# EAGLE schematic drivercontrols_adafruit_M0 (EAGLE 9.5.2)
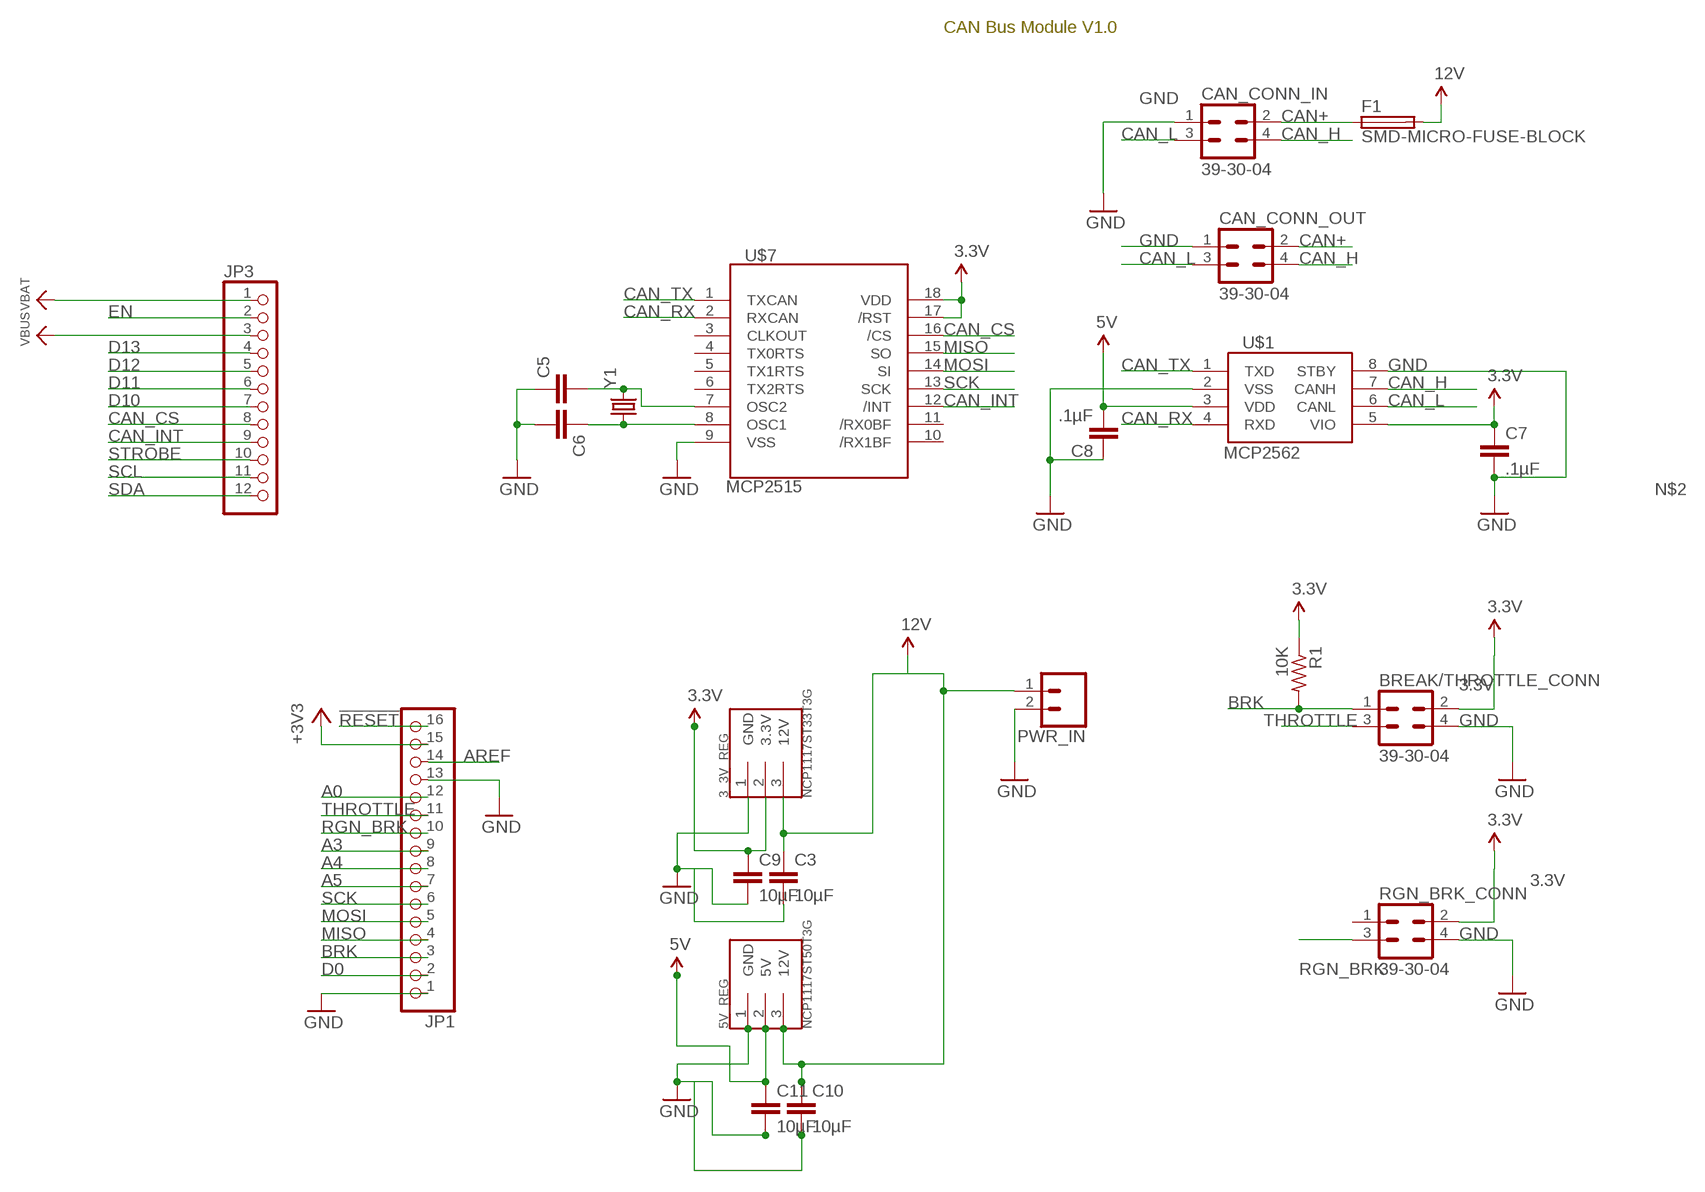
[diagram p0: schematic, sheet 1]

## Parts
3_3V_REG  NCP1117ST33T3G  [SOT223]
5V_REG  NCP1117ST50T3G  [SOT223]
BREAK/THROTTLE_CONN  39-30-04  [39-30-?04?]
C3  10µF  CAP0805  [0805]
C5  CAP0805  [0805]
C6  CAP0805  [0805]
C7  .1µF  CAP0805  [0805]
C8  .1µF  CAP0805  [0805]
C9  10µF  CAP0805  [0805]
C10  10µF  CAP0805  [0805]
C11  10µF  CAP0805  [0805]
CAN_CONN_IN  39-30-04  [39-30-?04?]
CAN_CONN_OUT  39-30-04  [39-30-?04?]
F1  SMD-MICRO-FUSE-BLOCK  [OMNIBLOK]
JP1  HEADER-1X16ROUND  [1X16_ROUND]
JP3  HEADER-1X12  [1X12_ROUND]
PWR_IN  CONN_02  [1X02]
R1  10K  R-US_M0805  [M0805]
RGN_BRK_CONN  39-30-04  [39-30-?04?]
U$1  MCP2562  [SOIC8]
U$7  MCP2515  [SO-18W]
Y1  CRYSTALHC49US  [HC49US]

## Nets
3.3V: 3_3V_REG.2(3.3V) BREAK/THROTTLE_CONN.2 C7.1 C9.1 R1.1 RGN_BRK_CONN.2 U$1.5(VIO) U$7.17(/RST) U$7.18(VDD)
5V: 5V_REG.2(5V) C8.2 C11.1 U$1.3(VDD)
!RESET: JP1.16
+3V3: JP1.15
A0: JP1.12
A3: JP1.9
A4: JP1.8
A5: JP1.7
AREF: JP1.14
BRK: BREAK/THROTTLE_CONN.1 JP1.3 R1.2
CAN+: CAN_CONN_IN.2 CAN_CONN_OUT.2 F1.P$1
CAN_CS: JP3.8 U$7.16(/CS)
CAN_H: CAN_CONN_IN.4 CAN_CONN_OUT.4 U$1.7(CANH)
CAN_INT: JP3.9 U$7.12(/INT)
CAN_L: CAN_CONN_IN.3 CAN_CONN_OUT.3 U$1.6(CANL)
CAN_RX: U$1.4(RXD) U$7.2(RXCAN)
CAN_TX: U$1.1(TXD) U$7.1(TXCAN)
D0: JP1.2
D10: JP3.7
D11: JP3.6
D12: JP3.5
D13: JP3.4
EN: JP3.2
GND: 3_3V_REG.1(GND) 5V_REG.1(GND) BREAK/THROTTLE_CONN.4 C3.2 C5.1 C6.2 C7.2 C8.1 C9.2 C10.2 C11.2 CAN_CONN_IN.1 CAN_CONN_OUT.1 JP1.1 JP1.13 PWR_IN.2 RGN_BRK_CONN.4 U$1.2(VSS) U$1.8(STBY) U$7.9(VSS)
MISO: JP1.4 U$7.15(SO)
MOSI: JP1.5 U$7.14(SI)
N$1: C5.2 U$7.7(OSC2) Y1.2
N$2: 3_3V_REG.3(12V) 5V_REG.3(12V) C3.1 C10.1 F1.P$2 PWR_IN.1 ; supply symbol labelled 12V
N$11: C6.1 U$7.8(OSC1) Y1.1
RGN_BRK: JP1.10 RGN_BRK_CONN.3
SCK: JP1.6 U$7.13(SCK)
SCL: JP3.11
SDA: JP3.12
STROBE: JP3.10
THROTTLE: BREAK/THROTTLE_CONN.3 JP1.11
VBAT: JP3.1
VBUS: JP3.3
Unconnected: RGN_BRK_CONN.1 U$7.3(CLKOUT) U$7.4(TX0RTS) U$7.5(TX1RTS) U$7.6(TX2RTS) U$7.10(/RX1BF) U$7.11(/RX0BF)

## Notes on the sheet
- CAN Bus Module V1.0

## Library data of the parts
3_3V_REG = NUSOLAR_Custom:NCP1117ST33T3G
5V_REG = NUSOLAR_Custom:NCP1117ST50T3G
BREAK/THROTTLE_CONN CAN_CONN_IN CAN_CONN_OUT RGN_BRK_CONN = con-molex-mini-fit:39-30-?04?: HEADER
C3 C5-C11 = SparkFun-Capacitors:CAP: Capacitor Standard 0603 ceramic capacitor, and 0.1" leaded capacitor.
F1 = f-lf-omniblok-s:SMD-MICRO-FUSE
JP1 = microbuilder:HEADER-1X16: PIN HEADER
JP3 = microbuilder:HEADER-1X12
PWR_IN = SparkFun-Connectors:CONN_02: Multi connection point. Often used as Generic Header-pin footprint for 0.1 inch spaced/style header connections On any of the 0.1 inch spaced packages, you can populate with these: Break Away Headers - Straight <https://www.sparkfun.com/products/116> (PRT-00116) Break Away Male Headers - Right Angle <https://www.sparkfun.com/products/553> (PRT-00553) Female Headers <https://www.sparkfun.com/products/115> (PRT-00115) Break Away Headers - Machine Pin <https://www.sparkfun.com/products/117> (PRT-00117) Break Away Female Headers - Swiss Machine Pin <https://www.sparkfun.com/products/743> (PRT-00743) For SCREWTERMINALS and SPRING TERMINALS visit here: Screw Terimnals on SparkFun.com <https://www.sparkfun.com/search/results?term=Screw+Terminals> (5mm/3.5mm/2.54mm spacing) This device is also useful as a general connection point to wire up your design to another part of your project. Our various solder wires solder well into these plated through hole pads. Hook-Up Wire - Assortment (Stranded, 22 AWG) <https://www.sparkfun.com/products/11375> (PRT-11375) Hook-Up Wire - Assortment (Solid Core, 22 AWG) <https://www.sparkfun.com/products/11367> (PRT-11367) View the entire wire category on our website here <https://www.sparkfun.com/categories/141> Special notes: Molex polarized connector foot print use with: PRT-08233 with associated crimp pins and housings. 2.54_SCREWTERM for use with PRT-10571. 3.5mm Screw Terminal footprints for PRT-08084 5mm Screw Terminal footprints for use with PRT-08432
R1 = BeagleBone_Black_Wireless:R-US_: RESISTOR, American symbol
U$1 = NUSOLAR_Custom:MCP2562
U$7 = NUSOLAR_Custom:MCP2515
Y1 = SparkFun-FreqCtrl:CRYSTAL: Various standard crystals. Proven footprints.